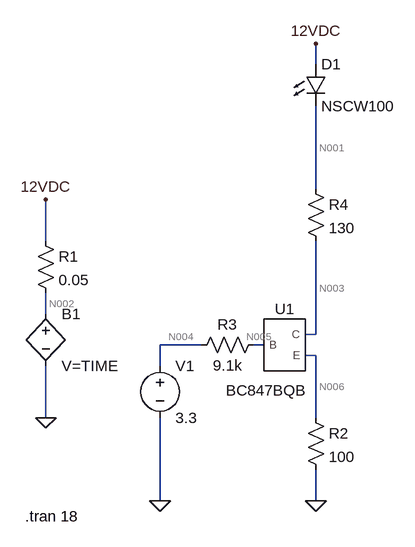
[diagram p0: schematic LED Current Source.asc]
LED Current Source.asc, the LTspice schematic file:
Version 4
SHEET 1 880 680
WIRE 384 -304 384 -336
WIRE 384 -112 384 -240
WIRE -32 -32 -32 -96
WIRE -32 80 -32 48
WIRE 384 112 384 -32
WIRE 384 112 368 112
WIRE 208 128 144 128
WIRE 304 128 288 128
WIRE 384 144 368 144
WIRE 144 160 144 128
WIRE -32 240 -32 160
WIRE 384 240 384 144
WIRE 144 368 144 240
WIRE 384 368 384 320
FLAG -32 240 0
FLAG -32 -96 12VDC
FLAG 384 -336 12VDC
FLAG 384 368 0
FLAG 144 368 0
SYMBOL voltage 144 144 R0
WINDOW 123 0 0 Left 0
WINDOW 39 0 0 Left 0
SYMATTR InstName V1
SYMATTR Value 3.3
SYMBOL res -48 -48 R0
SYMATTR InstName R1
SYMATTR Value 0.05
SYMBOL res 368 224 R0
SYMATTR InstName R2
SYMATTR Value 100
SYMBOL res 304 112 R90
WINDOW 0 0 56 VBottom 2
WINDOW 3 32 56 VTop 2
SYMATTR InstName R3
SYMATTR Value 9.1k
SYMBOL bv -32 64 R0
SYMATTR InstName B1
SYMATTR Value V=TIME
SYMBOL LED 368 -304 R0
SYMATTR InstName D1
SYMATTR Value NSCW100
SYMBOL res 368 -128 R0
SYMATTR InstName R4
SYMATTR Value 130
SYMBOL BC847BQB 336 128 R0
WINDOW 3 -29 54 Top 2
SYMATTR InstName U1
TEXT -64 392 Left 2 !.tran 18

The netlist it stands for:
* LED Current Source.asc
V1 N004 0 3.3
R1 12VDC N002 0.05
R2 N006 0 100
R3 N005 N004 9.1k
B1 N002 0 V=TIME
D1 12VDC N001 NSCW100
R4 N001 N003 130
XU1 N003 N005 N006 BC847BQB  ; pins C B E
.model D D
.lib standard.dio
.tran 18
.lib C:\Uni\DashLogger\BC847BQB.txt
.backanno
.end

* Results of the author's LTspice run, read from the files saved beside the schematic
* Operating Point, zero values left out:
*   V(n004) = 3.3 V
*   V(n006) = 28.5 mV
*   V(n005) = 706.1 mV
*   V(n001) = 33.52 mV
*   V(n003) = 33.52 mV
*   I(B1) = 2.126 nA
*   I(D1) = -2.126 nA
*   I(R4) = -2.126 nA
*   I(R3) = -285 µA
*   I(R2) = 285 µA
*   I(R1) = 2.126 nA
*   I(V1) = -285 µA
*   Ix(u1:1) = -2.126 nA
*   Ix(u1:2) = 285 µA
*   Ix(u1:3) = -285 µA
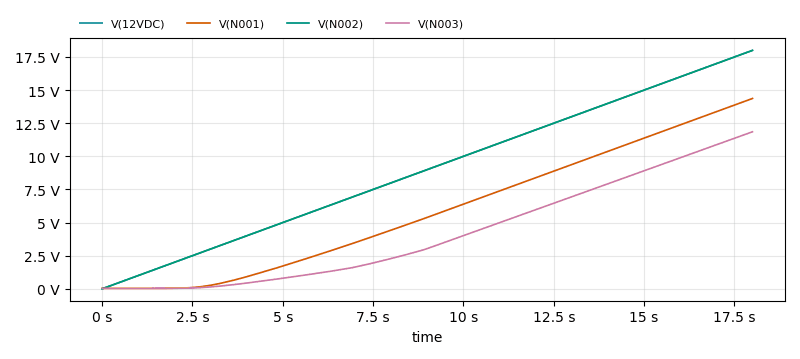
[diagram p1: Transient Analysis of LED Current Source.asc, plotted from the saved traces]
* Transient Analysis, 1 run:
*   V(12VDC): min 0 V, max 18 V, average 8.999 V, rms 10.45 V, last 18 V
*   V(N001): min 33.52 mV, max 14.37 V, average 5.835 V, rms 7.522 V, last 14.37 V
*   V(N002): min 0 V, max 18 V, average 9 V, rms 10.46 V, last 18 V
*   V(N003): min 33.52 mV, max 11.85 V, average 4.167 V, rms 5.742 V, last 11.85 V